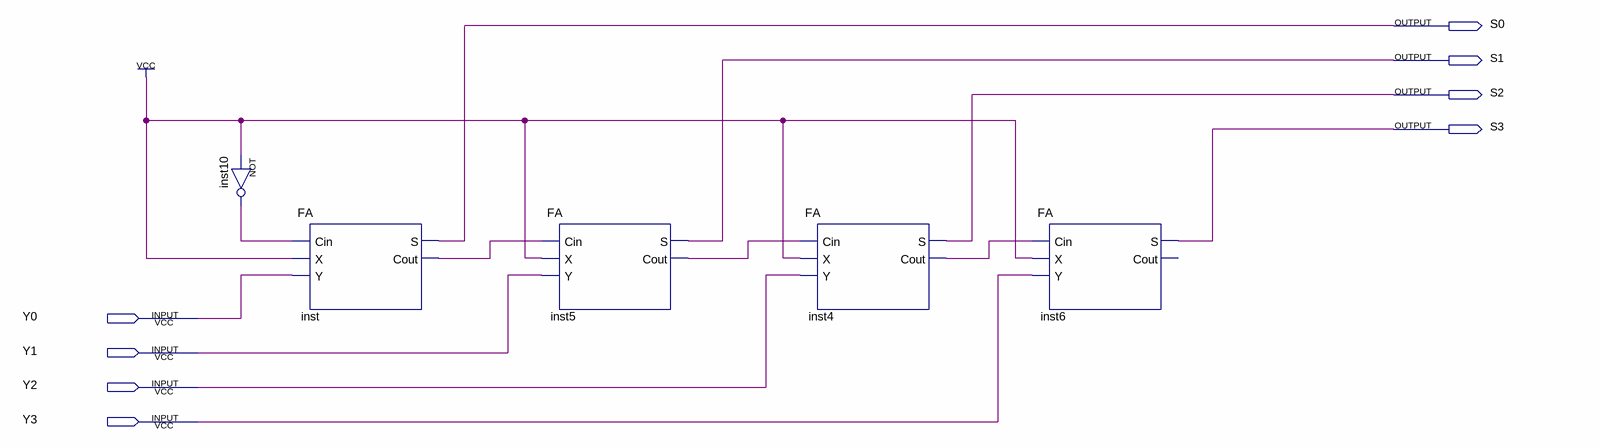
[diagram p0: schematic sheet]
// Quartus schematic 4_Bit_Decrementer.bdf as structural Verilog: 5 symbols, 8 pins
module \4_Bit_Decrementer  (
  input  Y0,
  input  Y1,
  input  Y2,
  input  Y3,
  output S0,
  output S1,
  output S2,
  output S3
);

  wire inst4_cout, inst5_cout, inst10_out, inst_cout;

  not inst10 (inst10_out, 1'b1);
  FA inst (.Cin(inst10_out), .X(1'b1), .Y(Y0), .S(S0), .Cout(inst_cout));
  FA inst5 (.Cin(inst_cout), .X(1'b1), .Y(Y1), .S(S1), .Cout(inst5_cout));
  FA inst4 (.Cin(inst5_cout), .X(1'b1), .Y(Y2), .S(S2), .Cout(inst4_cout));
  FA inst6 (.Cin(inst4_cout), .X(1'b1), .Y(Y3), .S(S3));  // open: Cout
endmodule
